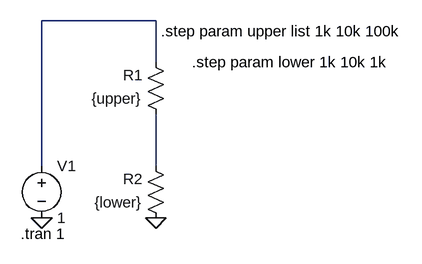
[diagram p0: schematic Step_Example.asc]
Step_Example.asc, the LTspice schematic file:
Version 4
SHEET 1 880 680
WIRE 144 -64 -32 -64
WIRE 144 0 144 -64
WIRE -32 160 -32 -64
WIRE 144 160 144 80
FLAG -32 240 0
FLAG 144 240 0
SYMBOL voltage -32 144 R0
WINDOW 123 0 0 Left 0
WINDOW 39 0 0 Left 0
SYMATTR InstName V1
SYMATTR Value 1
SYMBOL res 160 96 R180
WINDOW 0 36 76 Left 2
WINDOW 3 36 40 Left 2
SYMATTR InstName R1
SYMATTR Value {upper}
SYMBOL res 160 256 R180
WINDOW 0 36 76 Left 2
WINDOW 3 36 40 Left 2
SYMATTR InstName R2
SYMATTR Value {lower}
TEXT 152 -48 Left 2 !.step param upper list 1k 10k 100k
TEXT 200 0 Left 2 !.step param lower 1k 10k 1k
TEXT -64 264 Left 2 !.tran 1

The netlist it stands for:
* Step_Example.asc
V1 N001 0 1
R1 N002 N001 {upper}
R2 0 N002 {lower}
.step param upper list 1k 10k 100k
.step param lower 1k 10k 1k
.tran 1
.backanno
.end